# EAGLE design Core Shield Shield (EAGLE 6.4)
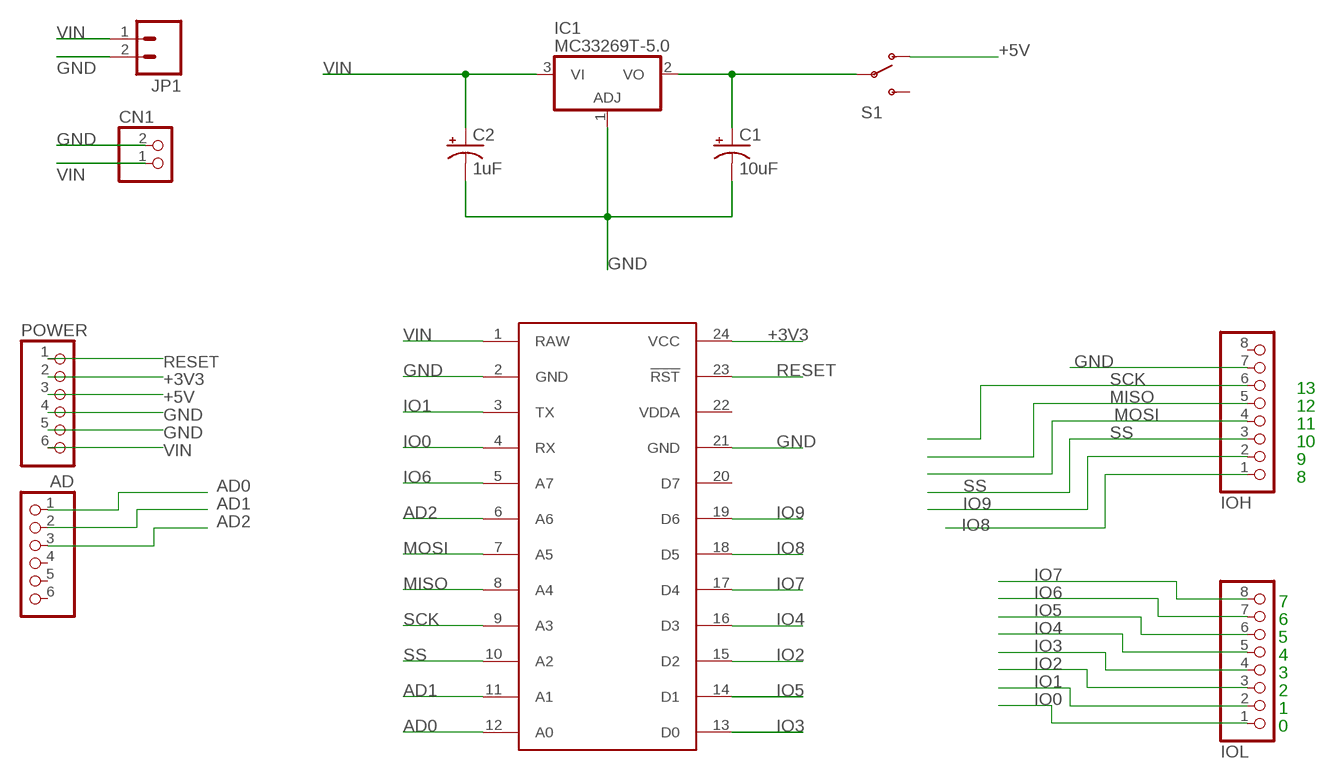
[diagram p0: schematic, sheet 1]

## Parts
AD  PINHD-1X6  [1X06]
C1  10uF  CAP_POLPTH2  [CPOL-RADIAL-10UF-25V]
C2  1uF  CAP_POLPTH2  [CPOL-RADIAL-10UF-25V]
CN1  JST_2PIN-THM  [JST-PH-2-THM]
IC1  MC33269T-5.0  [TO220V]
IOH  PINHD-1X8  [1X08]
IOL  PINHD-1X8  [1X08]
JP1  M02LOCK  [1X02_LOCK]
POWER  PINHD-1X6  [1X06]
S1  SWITCH-SPDTPTH  [SWITCH-SPDT]
U$1  SPARK_CORECORE  [SPARK_CORE]

## Nets
+3V3: POWER.2 U$1.24(VCC)
+5V: POWER.3 S1.1(O)
AD0: AD.1 U$1.12(A0)
AD1: AD.2 U$1.11(A1)
AD2: AD.3 U$1.6(A6)
GND: C1.2(-) C2.2(-) CN1.2 IC1.1(ADJ) IOH.7 JP1.2 POWER.4 POWER.5 U$1.2(GND) U$1.21(GND)
IO0: IOL.1 U$1.4(RX)
IO1: IOL.2 U$1.3(TX)
IO2: IOL.3 U$1.15(D2)
IO3: IOL.4 U$1.13(D0)
IO4: IOL.5 U$1.16(D3)
IO5: IOL.6 U$1.14(D1)
IO6: IOL.7 U$1.5(A7)
IO7: IOL.8 U$1.17(D4)
IO8: IOH.1 U$1.18(D5)
IO9: IOH.2 U$1.19(D6)
MISO: IOH.5 U$1.8(A4)
MOSI: IOH.4 U$1.7(A5)
N1: C1.1(+) IC1.2(VO) S1.2(P)
RESET: POWER.1 U$1.23(!RST)
SCK: IOH.6 U$1.9(A3)
SS: IOH.3 U$1.10(A2)
VIN: C2.1(+) CN1.1 IC1.3(VI) JP1.1 POWER.6 U$1.1(RAW)
Unconnected: AD.4 AD.5 AD.6 IOH.8 S1.3(S) U$1.20(D7)

## Notes on the sheet
- 13
- 12
- 11
- 10
- 9
- 8
- 7
- 6
- 5
- 4
- 3
- 2
- 1
- 0

## Power pins joined to a net without a drawn wire
VDDA: U$1.22(VDDA)

## Library data of the parts
AD POWER = pinhead:PINHD-1X6: PIN HEADER
C1 C2 = SparkFun-Capacitors:CAP_POL: Capacitor Polarized These are standard SMD and PTH capacitors. Normally 10uF, 47uF, and 100uF in electrolytic and tantalum varieties. Always verify the external diameter of the through hole cap, it varies with capacity, voltage, and manufacturer. The EIA devices should be standard.
CN1 = adafruit:JST_2PIN: JST 2-Pin Connectors of various flavors SMT-RA (S2B-PH-SM4) 4UConnector #17311 SMT (B2B-PH-SM4) THM-RA (S2B-PH) THM (B2B-PH)
IC1 = linear:MC33269?*: Adjustable Output Low Dropout Voltage Regulator 800 mA Source: http://www.onsemi.com/pub/Collateral/MC33269-D.PDF
IOH IOL = pinhead:PINHD-1X8: PIN HEADER
JP1 = SparkFun-Connectors:M02: Header 2 Standard 2-pin 0.1" header. Use with straight break away headers (SKU : PRT-00116), right angle break away headers (PRT-00553), swiss pins (PRT-00743), machine pins (PRT-00117), and female headers (PRT-00115). Molex polarized connector foot print use with SKU : PRT-08233 with associated crimp pins and housings.
S1 = SparkFun-Electromechanical:SWITCH-SPDT: SPDT Switch Simple slide switch, Spark Fun Electronics SKU : COM-00102 DPDT SMT slide switch, AYZ0202, SWCH-08179
U$1 = Spark:SPARK_CORE

## Net classes
0 default: width 0.152 mm, drill 0.305 mm, clearance 0.152 mm

## Board
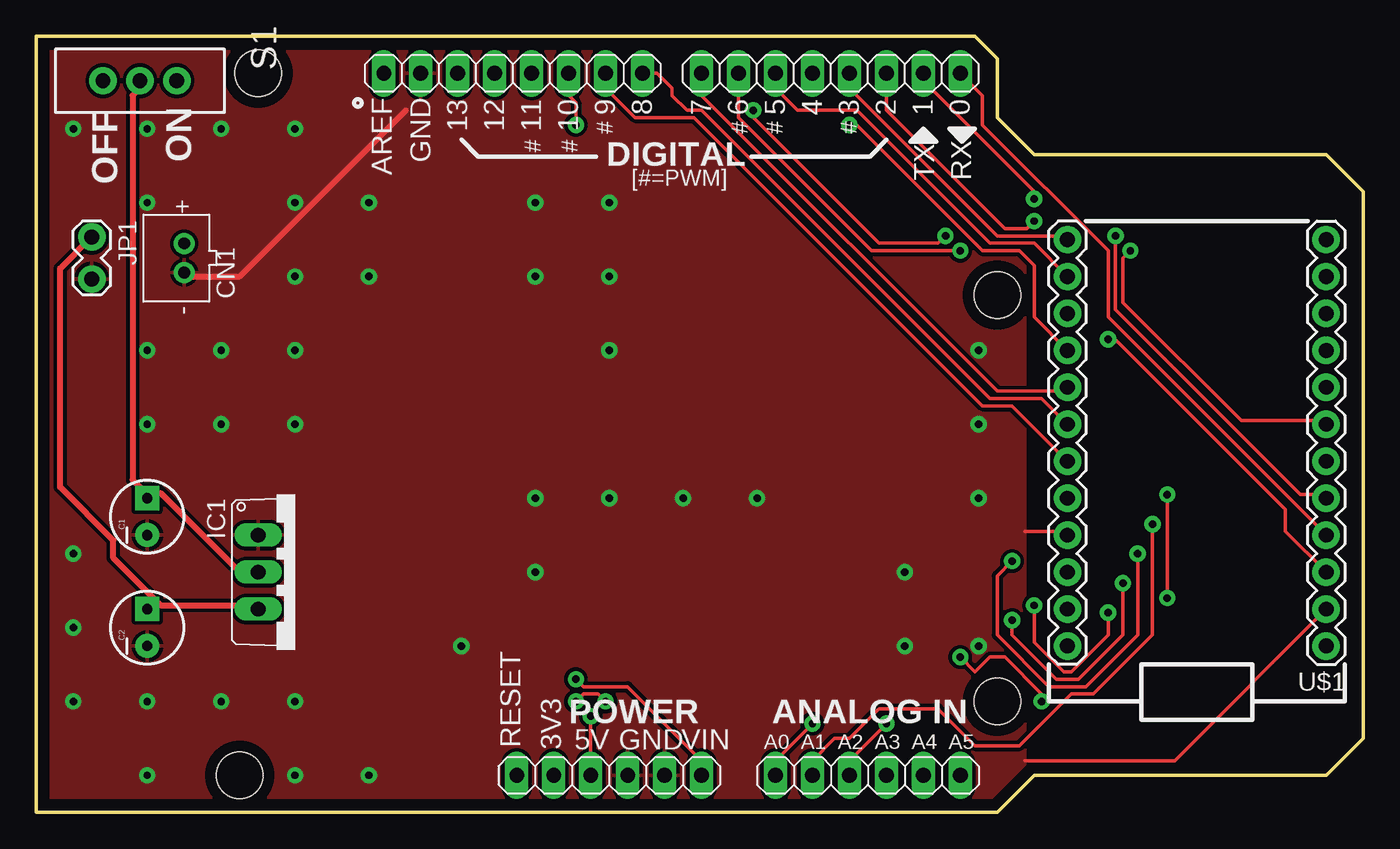
[diagram p1: board, top side]
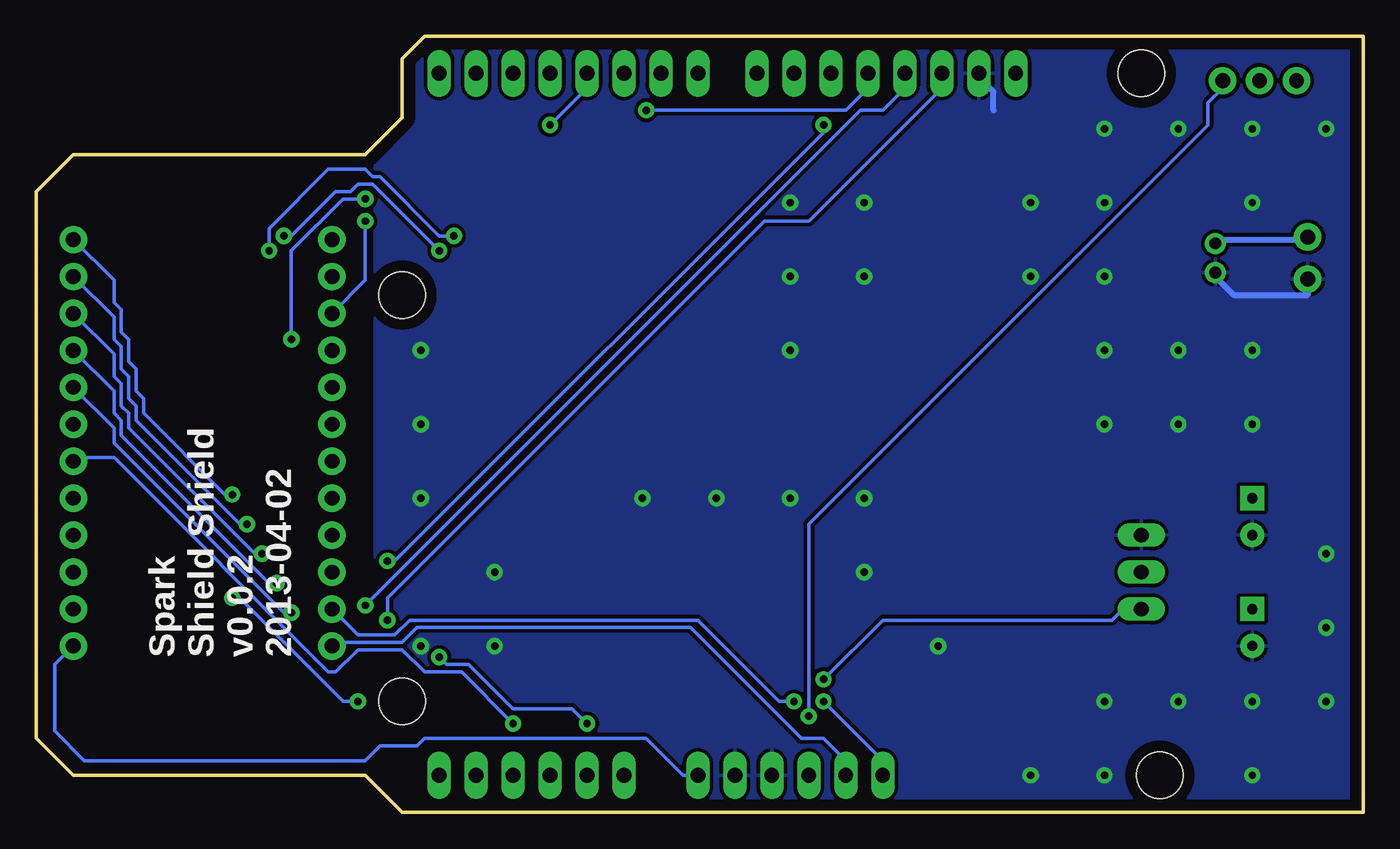
[diagram p2: board, bottom side, seen from below]

Size 91.19 x 53.34 mm. Coordinates in mm from the lower left corner, seen from the top.
Outline: 0,53.34 64.52,53.34 66.04,51.82 66.04,47.75 68.58,45.21 88.65,45.21 91.19,42.67 91.19,5.08 88.65,2.54 68.58,2.54 66.04,0 0,0 0,53.34
Copper layers (1*16): Top 0.035mm / dielectric 1.5mm / Bottom 0.035mm
Design rules "default *": minimum track width 10mil, minimum drill 12mil, track to track 10mil, track to pad 10mil, pad to pad 10mil, via to via 10mil, smd to smd 10mil, copper to edge 30mil, drill to drill 12mil, minimum pad ring 12mil, minimum via ring 12mil, stop-mask expansion 1mil, vias tented up to drill 0mil, thermal gap 10mil
Holes 3.2 mm at 66.04,35.56 66.04,7.62 15.24,50.8 13.97,2.54
vRestrict: area 47.9,10.3 to 48.5,10.8; area 50.4,10.2 to 50.9,11

### Footprints (pad centres in the part's own frame; a part is rotated, then mirrored left to right if it is on the bottom)
1X06 = drill 1.016 long: 1 -6.35,0; 2 -3.81,0; 3 -1.27,0; 4 1.27,0; 5 3.81,0; 6 6.35,0
CPOL-RADIAL-10UF-25V = drill 0.7 pad 1.651 square: 1 1.27,0 | drill 0.7 pad 1.651: 2 -1.27,0
JST-PH-2-THM = drill 0.8 pad 1.422: 1 1,0; 2 -1,0
TO220V = drill 1.016 long: 1 -2.54,-2.54; 2 0,-2.54; 3 2.54,-2.54
1X08 = drill 1.016 long: 1 -8.89,0; 2 -6.35,0; 3 -3.81,0; 4 -1.27,0; 5 1.27,0; 6 3.81,0; 7 6.35,0; 8 8.89,0
1X02_LOCK = drill 1.016 pad 1.88: 1 -0.178,0; 2 2.718,0
SWITCH-SPDT = drill 1.016 pad 1.88: 1 0,2.54; 2 0,0; 3 0,-2.54
SPARK_CORE = drill 1.016 pad 1.88: 1 -8.89,13.97; 2 -8.89,11.43; 3 -8.89,8.89; 4 -8.89,6.35; 5 -8.89,3.81; 6 -8.89,1.27; 7 -8.89,-1.27; 8 -8.89,-3.81; 9 -8.89,-6.35; 10 -8.89,-8.89; 11 -8.89,-11.43; 12 -8.89,-13.97; 13 8.89,-13.97; 14 8.89,-11.43; 15 8.89,-8.89; 16 8.89,-6.35; 17 8.89,-3.81; 18 8.89,-1.27; 19 8.89,1.27; 20 8.89,3.81; 21 8.89,6.35; 22 8.89,8.89; 23 8.89,11.43; 24 8.89,13.97

### Placement (x,y rotation side)
AD  57.15,2.54 0 top
C1  7.62,20.32 90 top
C2  7.62,12.7 90 top
CN1  10.16,38.1 90 top
IC1  17.78,16.51 270 top
IOH  32.77,50.8 180 top
IOL  54.61,50.8 180 top
JP1  3.81,39.37 270 top
POWER  39.37,2.54 0 top
S1  7.11,50.29 270 top
U$1  79.76,25.4 180 top
U$2  [SPARK_LOGO]  1.27,1.27 0 top

### Tracks (layer width: path | path; a pad name or v marks a point on that pad's centre or on a via)
+3V3
  Bottom 0.254: POWER.2 35.56,3.56 37.08,5.08 38.61,5.08 46.23,12.7 65.02,12.7 66.04,11.68 70.61,11.68 U$1.24
+5V  (via drill 0.51)
  Top 0.254: v38.1,6.6 POWER.3
  Bottom 0.254: v38.1,6.6 38.1,19.81 10.67,47.24 10.67,48.77 9.65,49.78 S1.1
AD0  (via drill 0.51)
  Top 0.254: v77.72,14.73 v77.72,21.84 | v69.09,7.62 69.09,8.13 66.55,10.67 65.53,10.67 64.52,9.65 v63.5,10.67 | v53.34,6.1 50.8,3.56 AD.1
  Bottom 0.254: U$1.12 85.85,36.58 85.85,35.05 85.34,34.54 85.34,33.02 84.84,32.51 84.84,30.99 84.33,30.48 84.33,28.96 83.82,28.45 83.82,27.43 78.23,21.84 v77.72,21.84 | v77.72,14.73 77.22,14.73 70.1,7.62 v69.09,7.62 | v63.5,10.67 62.99,10.16 61.47,10.16 58.42,7.11 54.36,7.11 v53.34,6.1
AD1  (via drill 0.51)
  Top 0.254: v76.71,19.81 76.71,12.19 72.64,8.13 71.12,8.13 67.56,4.57 64.52,4.57 61.98,7.11 57.91,7.11 55.88,5.08 54.86,5.08 53.34,3.56 AD.2
  Bottom 0.254: U$1.11 85.85,34.04 85.85,32.51 85.34,32 85.34,30.48 84.84,29.97 84.84,28.45 84.33,27.94 84.33,26.92 77.22,19.81 v76.71,19.81
AD2  (via drill 0.51)
  Top 0.254: v58.42,6.1 55.88,3.56 AD.3
  Bottom 0.254: v58.42,6.1 61.98,9.65 64.52,9.65 66.04,11.18 69.09,11.18 70.61,9.65 71.12,9.65 85.85,24.38 88.39,24.38 U$1.6
GND  (via drill 0.51)
  Top 0.254: 67.94,19.3 70.61,19.3 U$1.21 | U$1.2 78.23,3.56 67.94,3.56
  Top 0.406: 25.4,48.26 13.97,36.83 10.16,36.83 CN1.2
  Bottom 0.406: 25.4,48.26 25.4,49.53 26.67,50.8 IOH.7 | 3.81,36.83 JP1.2 3.81,35.56 8.89,35.56 10.16,36.83 CN1.2
  other vias: 2.54,7.62 7.62,7.62 7.62,2.54 12.7,7.62 17.78,7.62 17.78,2.54 22.86,2.54 2.54,12.7 2.54,17.78 7.62,26.67 7.62,31.75 7.62,41.91 7.62,46.99 2.54,46.99 12.7,46.99 17.78,46.99 17.78,41.91 17.78,36.83 17.78,31.75 17.78,26.67 12.7,31.75 12.7,26.67 22.86,41.91 22.86,36.83 34.29,41.91 39.37,41.91 39.37,36.83 39.37,31.75 39.37,21.59 34.29,21.59 44.45,21.59 34.29,16.51 29.21,11.43 49.53,21.59 64.77,21.59 59.69,16.51 59.69,11.43 64.77,11.43 64.77,26.67 64.77,31.75 34.29,36.83
  pour Bottom (rank 2): 0.64,52.7 67.69,52.7 67.94,52.45 67.94,0.64 0.89,0.64 0.64,0.89 0.64,30.48 0.64,46.35
  pour Top (rank 2): 0.64,52.7 67.94,52.7 67.94,0.64 0.64,0.64 0.64,30.48 0.64,46.35
IO0
  Top 0.254: U$1.4 73.66,34.04 73.66,38.61 65.02,47.24 65.02,49.28 IOL.1
IO1  (via drill 0.51)
  Top 0.254: U$1.3 85.85,19.3 85.85,20.83 74.17,32.51 v73.66,32.51 | v68.58,42.16 68.58,42.67 60.96,50.29 IOL.2
  Bottom 0.254: v73.66,32.51 73.66,38.61 70.1,42.16 v68.58,42.16
IO2  (via drill 0.51)
  Top 0.254: v68.58,40.64 68.07,40.13 66.55,40.13 58.42,48.26 IOL.3
  Bottom 0.254: U$1.15 68.58,36.58 v68.58,40.64
IO3
  Top 0.254: IOL.4 55.88,49.78 66.04,39.62 70.61,39.62 U$1.13
IO4  (via drill 0.51)
  Top 0.254: U$1.16 68.58,34.04 68.58,37.59 67.56,38.61 65.02,38.61 56.39,47.24 v55.88,47.24
  Bottom 0.254: v55.88,47.24 53.34,49.78 IOL.5
IO5
  Top 0.254: U$1.14 68.58,39.12 65.53,39.12 56.39,48.26 52.32,48.26 50.8,49.78 IOL.6
IO6  (via drill 0.51)
  Top 0.254: v74.17,39.62 74.17,34.54 86.87,21.84 88.39,21.84 U$1.5 | v63.5,38.61 57.4,38.61 48.26,47.75 IOL.7
  Bottom 0.254: v74.17,39.62 73.66,39.62 70.61,42.67 69.6,42.67 69.09,43.18 68.07,43.18 v63.5,38.61
IO7
  Top 0.254: IOL.8 45.72,49.28 66.04,28.96 70.61,28.96 U$1.17
IO8
  Top 0.254: U$1.18 69.09,28.45 65.53,28.45 45.72,48.26 44.7,48.26 43.69,49.28 43.69,49.78 42.67,50.8 IOH.1
IO9
  Top 0.254: U$1.19 67.06,27.94 65.02,27.94 45.21,47.75 41.15,47.75 39.12,49.78 IOH.2
MISO  (via drill 0.51)
  Top 0.254: v73.66,13.72 73.66,12.19 71.12,9.65 70.61,9.65 68.58,11.68 v68.58,14.22
  Bottom 0.254: U$1.8 85.85,26.42 85.85,25.4 74.17,13.72 v73.66,13.72 | v68.58,14.22 34.54,48.26 33.02,48.26 31.5,49.78 IOH.5
MOSI  (via drill 0.51)
  Top 0.254: v75.18,38.61 74.68,38.1 74.68,35.05 82.8,26.92 88.39,26.92 U$1.7 | v62.48,39.62 61.98,39.12 57.91,39.12 49.28,47.75 v49.28,48.26
  Bottom 0.254: v75.18,38.61 75.18,40.13 71.12,44.2 68.58,44.2 68.07,43.69 67.56,43.69 63.5,39.62 v62.48,39.62 | v49.28,48.26 35.56,48.26 34.04,49.78 IOH.4
  Bottom 0.406: 34.29,50.8 IOH.4
N1
  Top 0.406: IC1.2 15.04,16.66 13.82,16.66 8.53,21.95 7.72,21.95 C1.1 7.62,21.84 6.6,22.86 6.6,49.28 7.11,49.78 S1.2
RESET  (via drill 0.51)
  Top 0.254: v39.12,7.62 38.61,8.13 37.59,8.13 v37.08,7.62
  Bottom 0.254: U$1.23 69.09,12.19 66.55,12.19 65.53,13.21 45.72,13.21 40.13,7.62 v39.12,7.62 | v37.08,7.62 33.02,3.56 POWER.1
SCK  (via drill 0.51)
  Top 0.254: IOH.6 28.96,49.78 | v74.68,15.75 74.68,12.19 71.63,9.14 70.1,9.14 67.06,12.19 v67.06,13.21
  Bottom 0.254: U$1.9 85.85,28.96 85.85,27.43 85.34,26.92 85.34,25.91 75.18,15.75 v74.68,15.75 | v67.06,13.21 67.06,14.73 41.15,40.64 38.1,40.64 28.96,49.78 IOH.6
SS  (via drill 0.51)
  Top 0.254: 36.58,50.29 36.58,49.78 | v75.69,17.78 75.69,12.19 72.14,8.64 69.6,8.64 66.04,12.19 66.04,16.26 v67.06,17.27 | v37.08,47.24 37.08,48.77 36.07,49.78 36.58,50.29 | 36.58,50.29 IOH.3
  Bottom 0.254: U$1.10 85.85,31.5 85.85,29.97 85.34,29.46 85.34,27.94 84.84,27.43 84.84,26.42 76.2,17.78 v75.69,17.78 | v67.06,17.27 66.55,17.27 37.08,46.74 v37.08,47.24
VIN  (via drill 0.51)
  Top 0.254: 8.53,14.22 7.72,14.22 C2.1 | 15.04,14.22 IC1.3 | 3.66,39.42 JP1.1 | POWER.6 45.72,3.56 40.64,8.64 37.59,8.64 v37.08,9.14
  Top 0.406: 15.04,14.22 8.53,14.22 5.28,17.48 5.28,18.69 1.63,22.35 1.63,37.39 3.66,39.42
  Bottom 0.254: U$1.1 89.92,10.16 89.92,5.59 87.88,3.56 68.58,3.56 67.56,4.57 65.02,4.57 64.52,5.08 49.28,5.08 46.74,2.54 POWER.6 | v37.08,9.14 33.02,13.21 17.27,13.21 16.76,13.72 15.24,13.72 IC1.3
  Bottom 0.406: JP1.1 3.81,39.37 10.16,39.37 CN1.1

### Text on the board
tPlace: 13 | 12 | 11 | 10 | 9 | 8 | 7 | 6 | 5 | 4 | 3 | 2 | 1 | 0 | ON | OFF
bPlace: Spark / Shield Shield / v0.0.2 / 2013-04-02
tNames: AREF | GND | # | # | # | # | # | # | DIGITAL | [#=PWM] | TX | RX | ANALOG IN | RESET | 3V3 | 5V | GND | VIN | A0 | A1 | A2 | A3 | A4 | A5
214bmp: D:/SmartProjects/Snc/a4_bn_logo2.bmp